# EAGLE schematic romashnik (EAGLE 6.1)
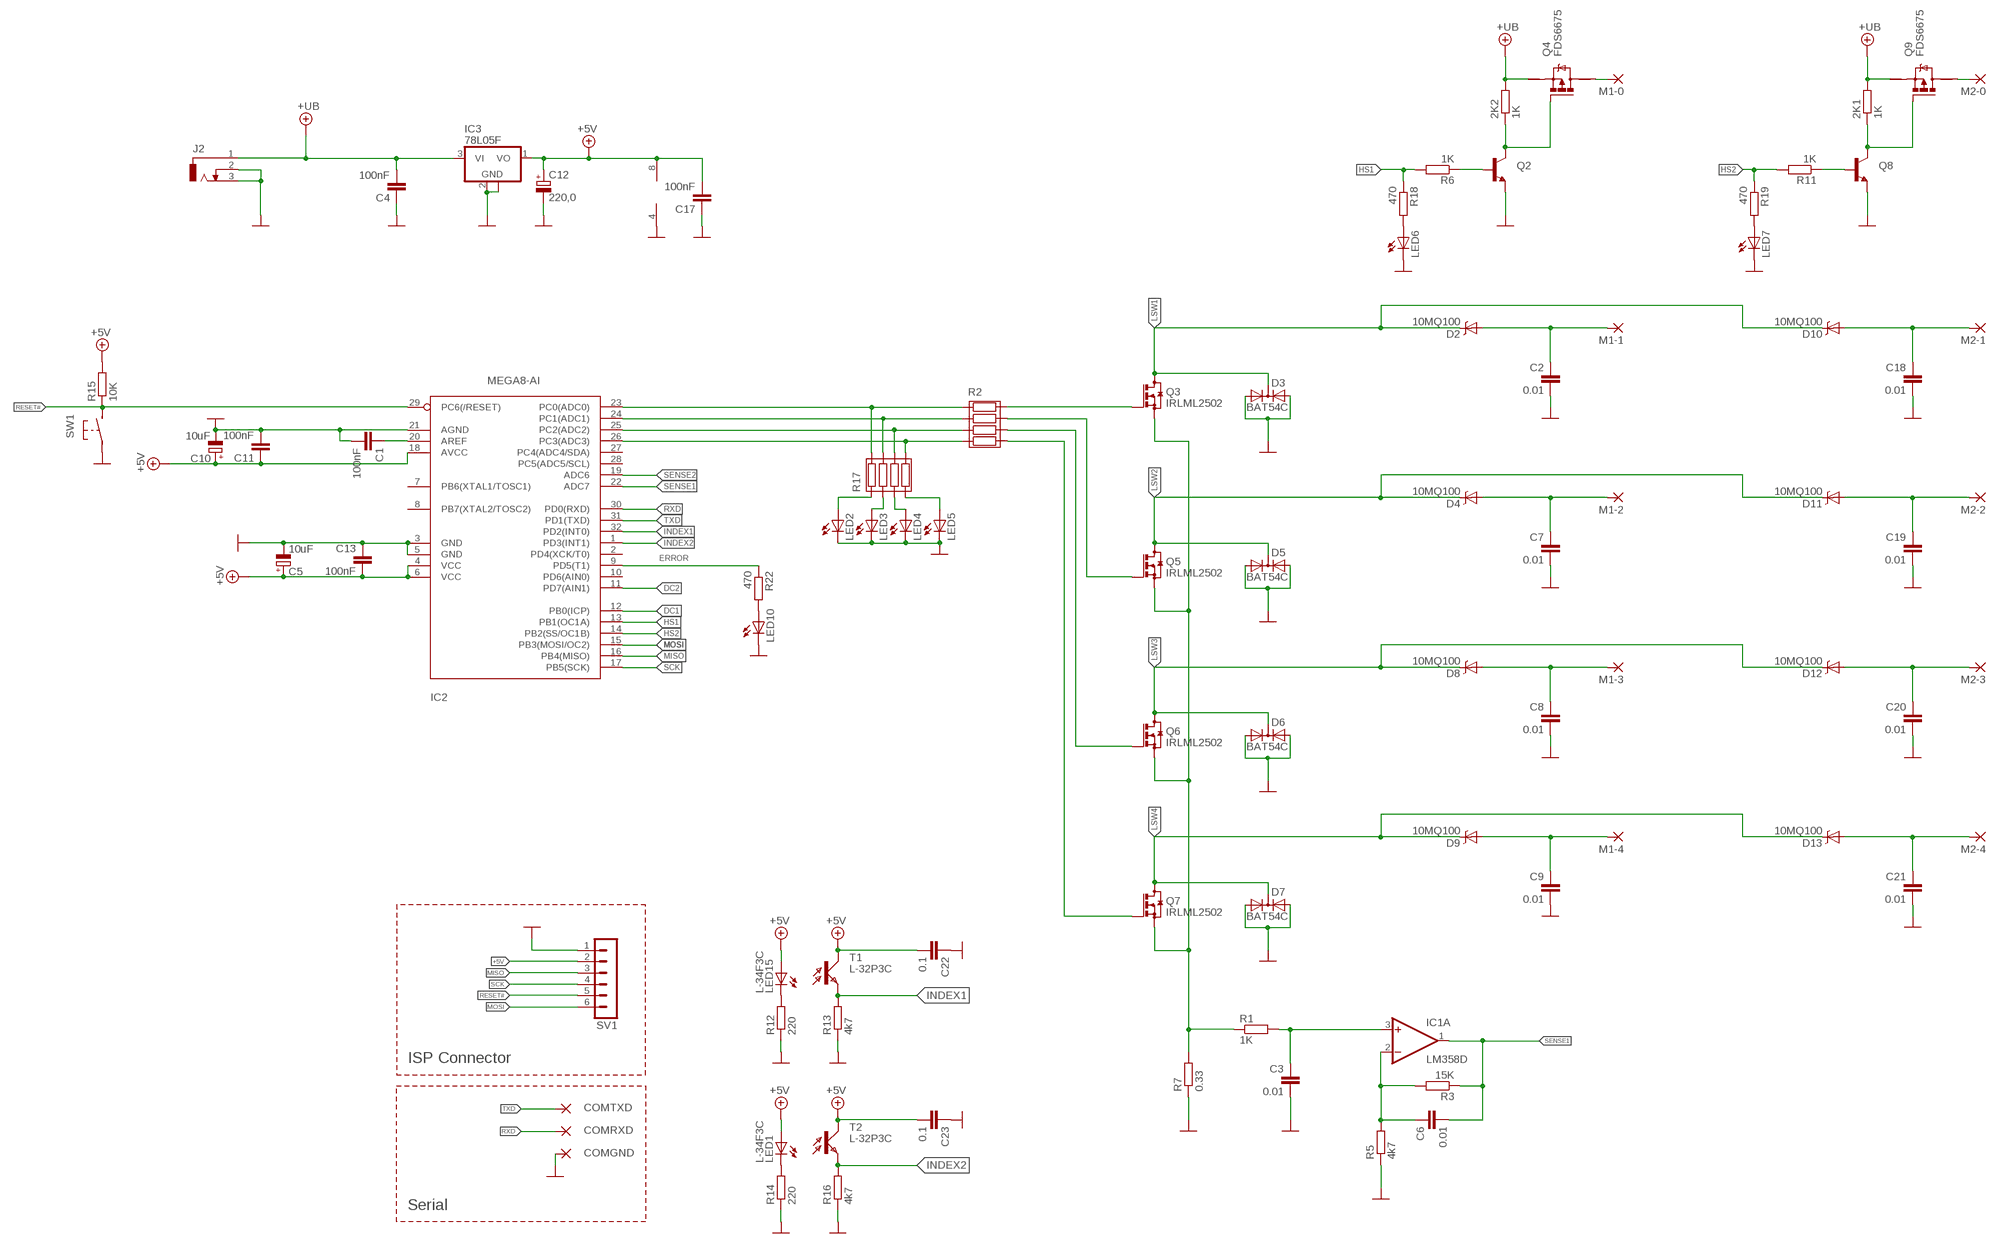
[diagram p0: schematic, sheet 1, part 1 of 2]
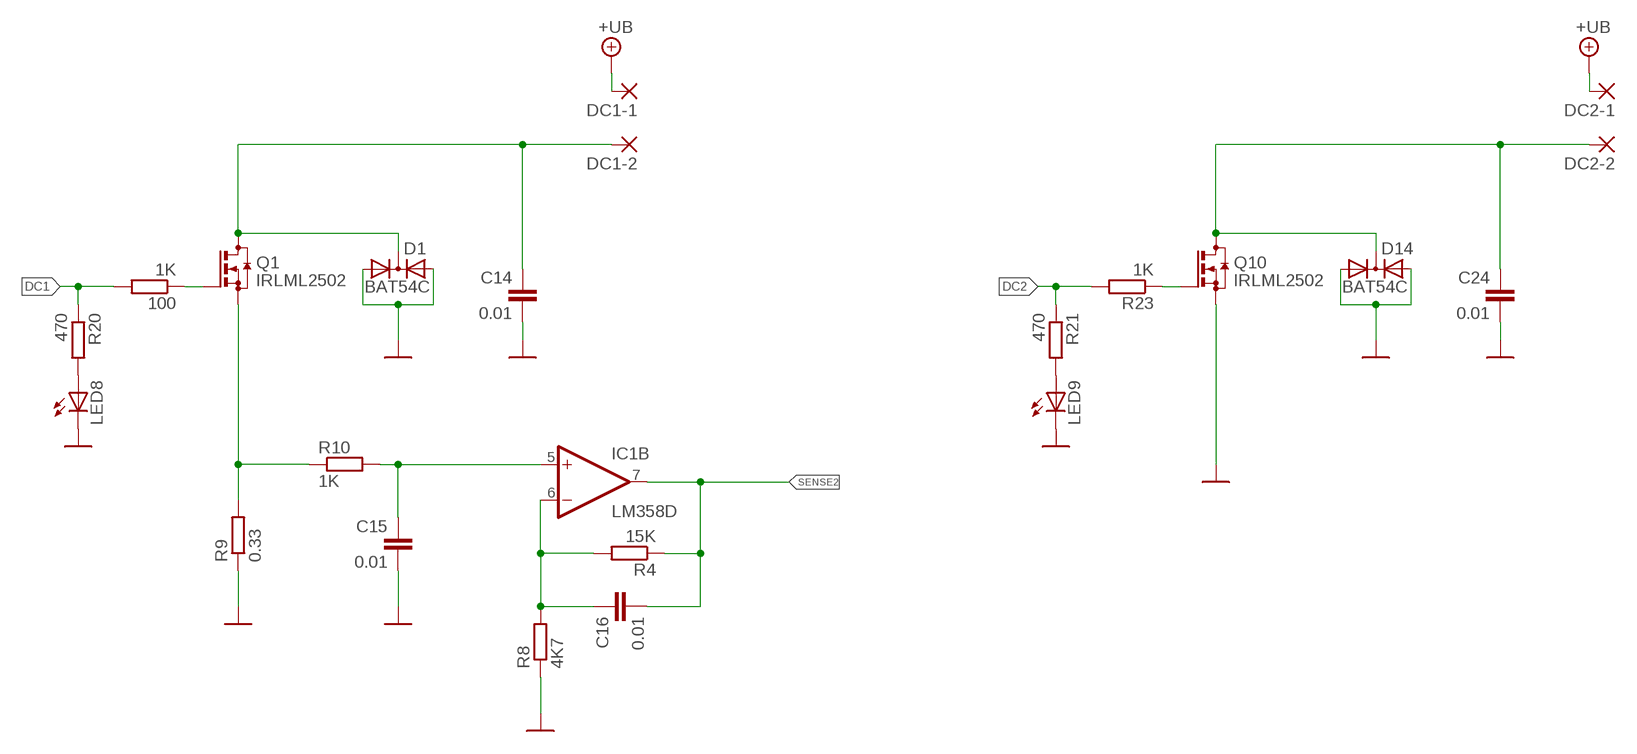
[diagram p1: schematic, sheet 1, part 2 of 2]

## Parts
2K1  1K  R-EU_R0805S  [R0805-SVO]
2K2  1K  R-EU_R0805S  [R0805-SVO]
100  1K  R-EU_R0805S  [R0805-SVO]
C1  100nF  C-EUC0603K  [C0603K]
C2  0.01  C-EUC0603K  [C0603K]
C3  0.01  C-EUC0603K  [C0603K]
C4  100nF  C-EUC0603K  [C0603K]
C5  10uF  CPOL-EUSMCB  [SMC_B]
C6  0.01  C-EUC0603K  [C0603K]
C7  0.01  C-EUC0603K  [C0603K]
C8  0.01  C-EUC0603K  [C0603K]
C9  0.01  C-EUC0603K  [C0603K]
C10  10uF  CPOL-EUSMCB  [SMC_B]
C11  100nF  C-EUC0603K  [C0603K]
C12  220,0  CPOL-EUB/3528-21R  [B/3528-21R]
C13  100nF  C-EUC0603K  [C0603K]
C14  0.01  C-EUC0603K  [C0603K]
C15  0.01  C-EUC0603K  [C0603K]
C16  0.01  C-EUC0603K  [C0603K]
C17  100nF  C-EUC0603K  [C0603K]
C18  0.01  C-EUC0603K  [C0603K]
C19  0.01  C-EUC0603K  [C0603K]
C20  0.01  C-EUC0603K  [C0603K]
C21  0.01  C-EUC0603K  [C0603K]
C22  0.1  C-EUC0603K  [C0603K]
C23  0.1  C-EUC0603K  [C0603K]
C24  0.01  C-EUC0603K  [C0603K]
COMGND  1,6/0,8  [1,6/0,8]
COMRXD  1,6/0,8  [1,6/0,8]
COMTXD  1,6/0,8  [1,6/0,8]
D1  BAT54C  DIODE-2AC|CASOT23  [SOT23@1]
D2  10MQ100  DIODE-SCHOTTKY_  [SMA-DIODE]
D3  BAT54C  DIODE-2AC|CASOT23  [SOT23@1]
D4  10MQ100  DIODE-SCHOTTKY_  [SMA-DIODE]
D5  BAT54C  DIODE-2AC|CASOT23  [SOT23@1]
D6  BAT54C  DIODE-2AC|CASOT23  [SOT23@1]
D7  BAT54C  DIODE-2AC|CASOT23  [SOT23@1]
D8  10MQ100  DIODE-SCHOTTKY_  [SMA-DIODE]
D9  10MQ100  DIODE-SCHOTTKY_  [SMA-DIODE]
D10  10MQ100  DIODE-SCHOTTKY_  [SMA-DIODE]
D11  10MQ100  DIODE-SCHOTTKY_  [SMA-DIODE]
D12  10MQ100  DIODE-SCHOTTKY_  [SMA-DIODE]
D13  10MQ100  DIODE-SCHOTTKY_  [SMA-DIODE]
D14  BAT54C  DIODE-2AC|CASOT23  [SOT23@1]
DC1-1  1,6/0,8  [1,6/0,8]
DC1-2  1,6/0,8  [1,6/0,8]
DC2-1  1,6/0,8  [1,6/0,8]
DC2-2  1,6/0,8  [1,6/0,8]
IC1  LM358D  [SO08]
IC2  MEGA8-AI  [TQFP32-08]
IC3  78L05F  [SOT89]
J2  DCJ-SMALL  [DCJ-SMALL]
LED1  L-34F3C  LED3MM  [LED3MM]
LED2  LEDCHIPLED_0603  [CHIPLED_0603]
LED3  LEDCHIPLED_0603  [CHIPLED_0603]
LED4  LEDCHIPLED_0603  [CHIPLED_0603]
LED5  LEDCHIPLED_0603  [CHIPLED_0603]
LED6  LEDCHIPLED_0603  [CHIPLED_0603]
LED7  LEDCHIPLED_0603  [CHIPLED_0603]
LED8  LEDCHIPLED_0603  [CHIPLED_0603]
LED9  LEDCHIPLED_0603  [CHIPLED_0603]
LED10  LEDCHIPLED_0603  [CHIPLED_0603]
LED15  L-34F3C  LED3MM  [LED3MM]
M1-0  1,6/0,8  [1,6/0,8]
M1-1  1,6/0,8  [1,6/0,8]
M1-2  1,6/0,8  [1,6/0,8]
M1-3  1,6/0,8  [1,6/0,8]
M1-4  1,6/0,8  [1,6/0,8]
M2-0  1,6/0,8  [1,6/0,8]
M2-1  1,6/0,8  [1,6/0,8]
M2-2  1,6/0,8  [1,6/0,8]
M2-3  1,6/0,8  [1,6/0,8]
M2-4  1,6/0,8  [1,6/0,8]
Q1  IRLML2502  BSS123  [SOT23]
Q2  TRANSISTOR_NPNSOT23-3  [SOT23-3]
Q3  IRLML2502  BSS123  [SOT23]
Q4  FDS6675  P-MOSFET-SO8  [SO-08]
Q5  IRLML2502  BSS123  [SOT23]
Q6  IRLML2502  BSS123  [SOT23]
Q7  IRLML2502  BSS123  [SOT23]
Q8  TRANSISTOR_NPNSOT23-3  [SOT23-3]
Q9  FDS6675  P-MOSFET-SO8  [SO-08]
Q10  IRLML2502  BSS123  [SOT23]
R1  1K  R-EU_R0805S  [R0805-SVO]
R2  RES4  [RESSMD-YC16]
R3  15K  R-EU_R0805S  [R0805-SVO]
R4  15K  R-EU_R0805S  [R0805-SVO]
R5  4k7  R-EU_R0805S  [R0805-SVO]
R6  1K  R-EU_R0805S  [R0805-SVO]
R7  0.33  R-EU_R2512  [R2512]
R8  4K7  R-EU_R0805S  [R0805-SVO]
R9  0.33  R-EU_R2512  [R2512]
R10  1K  R-EU_R0805S  [R0805-SVO]
R11  1K  R-EU_R0805S  [R0805-SVO]
R12  220  R-EU_R0805S  [R0805-SVO]
R13  4k7  R-EU_R0805S  [R0805-SVO]
R14  220  R-EU_R0805S  [R0805-SVO]
R15  10K  R-EU_R0805S  [R0805-SVO]
R16  4k7  R-EU_R0805S  [R0805-SVO]
R17  RES4  [RESSMD-YC16]
R18  470  R-EU_R0805S  [R0805-SVO]
R19  470  R-EU_R0805S  [R0805-SVO]
R20  470  R-EU_R0805S  [R0805-SVO]
R21  470  R-EU_R0805S  [R0805-SVO]
R22  470  R-EU_R0805S  [R0805-SVO]
R23  1K  R-EU_R0805S  [R0805-SVO]
SV1  MA06-1  [MA06-1]
SW1  BUTTON-IT_1181  [SW_IT1181]
T1  L-32P3C  BPX81  [BPX81]
T2  L-32P3C  BPX81  [BPX81]

## Nets
+5V: C5.+ C10.+ C11.1 C12.+ C13.2 C17.2 C22.2 C23.2 IC1.8(P:V+) IC2.4(VCC) IC2.6(VCC) IC2.18(AVCC) IC3.1(VO) LED1.A LED15.A R15.2 SV1.2 T1.C T2.C
+UB: 2K1.2 2K2.2 C4.2 DC1-1.1(P) DC2-1.1(P) IC3.3(VI) J2.1 Q4.1(S) Q9.1(S)
DC1: 100.2 IC2.12(PB0(ICP)) R20.1
DC2: IC2.11(PD7(AIN1)) R21.1 R23.2
DCMOTEUR1: C14.1 D1.3(C) DC1-2.1(P) Q1.3(D)
DCMOTEUR2: C24.1 D14.3(C) DC2-2.1(P) Q10.3(D)
ERROR: IC2.9(PD5(T1)) R22.1
GATEQ3: Q3.1(G) R2.R1$2(1.2)
GATEQ5: Q5.1(G) R2.R2$2(2.2)
GATEQ6: Q6.1(G) R2.R3$2(3.2)
GATEQ7: Q7.1(G) R2.R4$2(4.2)
GND: C1.2 C2.2 C3.2 C4.1 C5.- C7.2 C8.2 C9.2 C10.- C11.2 C12.- C13.1 C14.2 C15.2 C17.1 C18.2 C19.2 C20.2 C21.2 C22.1 C23.1 C24.2 COMGND.1(P) D1.1(A1) D1.2(A2) D3.1(A1) D3.2(A2) D5.1(A1) D5.2(A2) D6.1(A1) D6.2(A2) D7.1(A1) D7.2(A2) D14.1(A1) D14.2(A2) IC1.4(P:V-) IC2.3(GND) IC2.5(GND) IC2.21(AGND) IC3.2(GND) IC3.2@1(GND) J2.2 J2.3 LED2.C LED3.C LED4.C LED5.C LED6.C LED7.C LED8.C LED9.C LED10.C Q2.2(E) Q8.2(E) Q10.2(S) R5.1 R7.1 R8.1 R9.1 R12.1 R13.1 R14.1 R16.1 SV1.1 SW1.P$1(P1)
HS1: IC2.13(PB1(OC1A)) R6.2 R18.1
HS2: IC2.14(PB2(SS/OC1B)) R11.2
HS3: R19.1
INDEX1: IC2.32(PD2(INT0)) R13.2 T1.E
INDEX2: IC2.1(PD3(INT1)) R16.2 T2.E
LSW1: D2.C D3.3(C) D10.C Q3.3(D)
LSW2: D4.C D5.3(C) D11.C Q5.3(D)
LSW3: D6.3(C) D8.C D12.C Q6.3(D)
LSW4: D7.3(C) D9.C D13.C Q7.3(D)
M1: C18.1 D10.A M2-1.1(P)
M2: C19.1 D11.A M2-2.1(P)
M3: C20.1 D12.A M2-3.1(P)
M4: C21.1 D13.A M2-4.1(P)
M11: C2.1 D2.A M1-1.1(P)
M12: C7.1 D4.A M1-2.1(P)
M13: C8.1 D8.A M1-3.1(P)
M14: C9.1 D9.A M1-4.1(P)
MISO: IC2.16(PB4(MISO)) SV1.3
MOSI: IC2.15(PB3(MOSI/OC2)) SV1.6
N$1: C3.1 IC1.3(A:+IN) R1.2
N$2: C6.1 IC1.2(A:-IN) R3.2 R5.2
N$3: IC2.23(PC0(ADC0)) R2.R1$1(1.1) R17.R1$2(1.2)
N$4: IC2.24(PC1(ADC1)) R2.R2$1(2.1) R17.R2$2(2.2)
N$5: C15.1 IC1.5(B:+IN) R10.2
N$6: IC2.25(PC2(ADC2)) R2.R3$1(3.1) R17.R3$2(3.2)
N$7: IC2.26(PC3(ADC3)) R2.R4$1(4.1) R17.R4$2(4.2)
N$8: 100.1 Q1.1(G)
N$9: 2K2.1 Q2.3(C) Q4.4(G)
N$10: C1.1 IC2.20(AREF)
N$11: Q2.1(B) R6.1
N$12: C16.1 IC1.6(B:-IN) R4.2 R8.2
N$13: M1-0.1(P) Q4.5(D)
N$14: LED15.K(C) R12.2
N$15: LED1.K(C) R14.2
N$16: LED3.A R17.R2$1(2.1)
N$17: LED4.A R17.R3$1(3.1)
N$18: 2K1.1 Q8.3(C) Q9.4(G)
N$19: Q8.1(B) R11.1
N$20: M2-0.1(P) Q9.5(D)
N$21: LED5.A R17.R4$1(4.1)
N$22: LED2.A R17.R1$1(1.1)
N$23: LED7.A R19.2
N$24: LED6.A R18.2
N$25: LED8.A R20.2
N$26: Q10.1(G) R23.1
N$27: LED9.A R21.2
N$28: LED10.A R22.2
RESET#: IC2.29(PC6(/RESET)) R15.1 SV1.5 SW1.P$2(P2)
RXD: COMRXD.1(P) IC2.30(PD0(RXD))
SCK: IC2.17(PB5(SCK)) SV1.4
SENSE1: C6.2 IC1.1(A:OUT) IC2.22(ADC7) R3.1
SENSE2: C16.2 IC1.7(B:OUT) IC2.19(ADC6) R4.1
SENSEGND: Q3.2(S) Q5.2(S) Q6.2(S) Q7.2(S) R1.1 R7.2
SENSEGND1: Q1.2(S) R9.2 R10.1
TXD: COMTXD.1(P) IC2.31(PD1(TXD))
Unconnected: IC2.2(PD4(XCK/T0)) IC2.7(PB6(XTAL1/TOSC1)) IC2.8(PB7(XTAL2/TOSC2)) IC2.10(PD6(AIN0)) IC2.27(PC4(ADC4/SDA)) IC2.28(PC5(ADC5/SCL)) Q4.2(S) Q4.3(S) Q4.6(D) Q4.7(D) Q4.8(D) Q9.2(S) Q9.3(S) Q9.6(D) Q9.7(D) Q9.8(D)

## Notes on the sheet
- ISP Connector
- Serial

## Library data of the parts
2K1 2K2 100 R1 R3-R6 R8 R10-R16 R18-R23 = rcl:R-EU_: RESISTOR, European symbol
C1-C4 C6-C9 C11 C13-C24 = rcl:C-EU: CAPACITOR, European symbol
C5 C10 C12 = rcl:CPOL-EU: POLARIZED CAPACITOR, European symbol
COMGND COMRXD COMTXD DC1-1 DC1-2 DC2-1 DC2-2 M1-0 M1-1-M1-4 M2-0 M2-1-M2-4 = wirepad:1,6/0,8: THROUGH-HOLE PAD
D1 D3 D5-D7 D14 = diode:DIODE-2AC|CA: Dual DIODE Anode-Cathode|Cathode-Anode
D2 D4 D8-D13 = SparkFun:DIODE-SCHOTTKY
IC1 = linear:LM358: OP AMP also LM158; LM258; LM2904 Source: http://cache.national.com/ds/LM/LM158.pdf
IC2 = atmel:MEGA8: MICROCONTROLLER 8 Kbytes FLASH, 1 kbytes SRAM, 512 bytes EEPROM, USART, 6-channel 10 bit ADC, 2-channel 8 bit ADC Pin compatible with Atmega48, ATMega88, ATMega168 Source: avr.lbr
IC3 = linear:78L*: POSITOIV-VOLTAGE REGULATORS Output up to 100 mA Source: http://focus.ti.com/lit/ds/symlink/ua78l05.pdf
J2 = 0-svo:DCJ-SMALL: Smaller DC power jack
LED1-LED10 LED15 = 0-svo:LED: LED OSRAM: - CHIPLED LG R971, LG N971, LY N971, LG Q971, LY Q971, LO R971, LY R971 LH N974, LH R974 LS Q976, LO Q976, LY Q976 LO Q996 - Hyper CHIPLED LW Q18S LB Q993, LB Q99A, LB R99A - SideLED LS A670, LO A670, LY A670, LG A670, LP A670 LB A673, LV A673, LT A673, LW A673 LH A674 LY A675 LS A676, LA A676, LO A676, LY A676, LW A676 LS A679, LY A679, LG A679 - Hyper Micro SIDELED® LS Y876, LA Y876, LO Y876, LY Y876 LT Y87S - SmartLED LW L88C, LW L88S LB L89C, LB L89S, LG L890 LS L89K, LO L89K, LY L89K LS L896, LA L896, LO L896, LY L896 - TOPLED LS T670, LO T670, LY T670, LG T670, LP T670 LSG T670, LSP T670, LSY T670, LOP T670, LYG T670 LG T671, LOG T671, LSG T671 LB T673, LV T673, LT T673, LW T673 LH T674 LS T676, LA T676, LO T676, LY T676, LB T676, LH T676, LSB T676, LW T676 LB T67C, LV T67C, LT T67C, LS T67K, LO T67K, LY T67K, LW E67C LS E67B, LA E67B, LO E67B, LY E67B, LB E67C, LV E67C, LT E67C LW T67C LS T679, LY T679, LG T679 LS T770, LO T770, LY T770, LG T770, LP T770 LB T773, LV T773, LT T773, LW T773 LH T774 LS E675, LA E675, LY E675, LS T675 LS T776, LA T776, LO T776, LY T776, LB T776 LHGB T686 LT T68C, LB T68C - Hyper Mini TOPLED® LB M676 - Mini TOPLED Santana® LG M470 LS M47K, LO M47K, LY M47K Source: http://www.osram.convergy.de/
Q1 Q3 Q5-Q7 Q10 = transistor-small-signal:BSS123: N-CHANNEL MOS FET
Q2 Q8 = SparkFun:TRANSISTOR_NPN: Transistor NPN BJT configuration in SOT23 package. MMBT2222 is the common NPN we use. Double check BCE configuration again layout.
Q4 Q9 = transistor-power:P-MOSFET-SO8: P-Channel MOSFET Example: FDS4435A; P-Channel Logic Level PowerTrench® MOSFET FDS4465; P-Channel 1.8V Specified PowerTrench® MOSFET Source: www.fairchildsemi.com
R2 R17 = 0-svo:RES4
R7 R9 = 0-rcl:R-EU_: RESISTOR, European symbol
SV1 = con-lstb:MA06-1: PIN HEADER; OC_FARNELL: unknown; OC_NEWARK: unknown
SW1 = 0-svo:BUTTON-IT_1181
T1 T2 = opto-trans-siemens:BPX81: PHOTO TRANSISTOR